# Altium schematic sheet cuk.SchDoc: cuh.SchDoc
size A4; DocumentNumber: 5; SheetNumber: 4; SheetTotal: 4
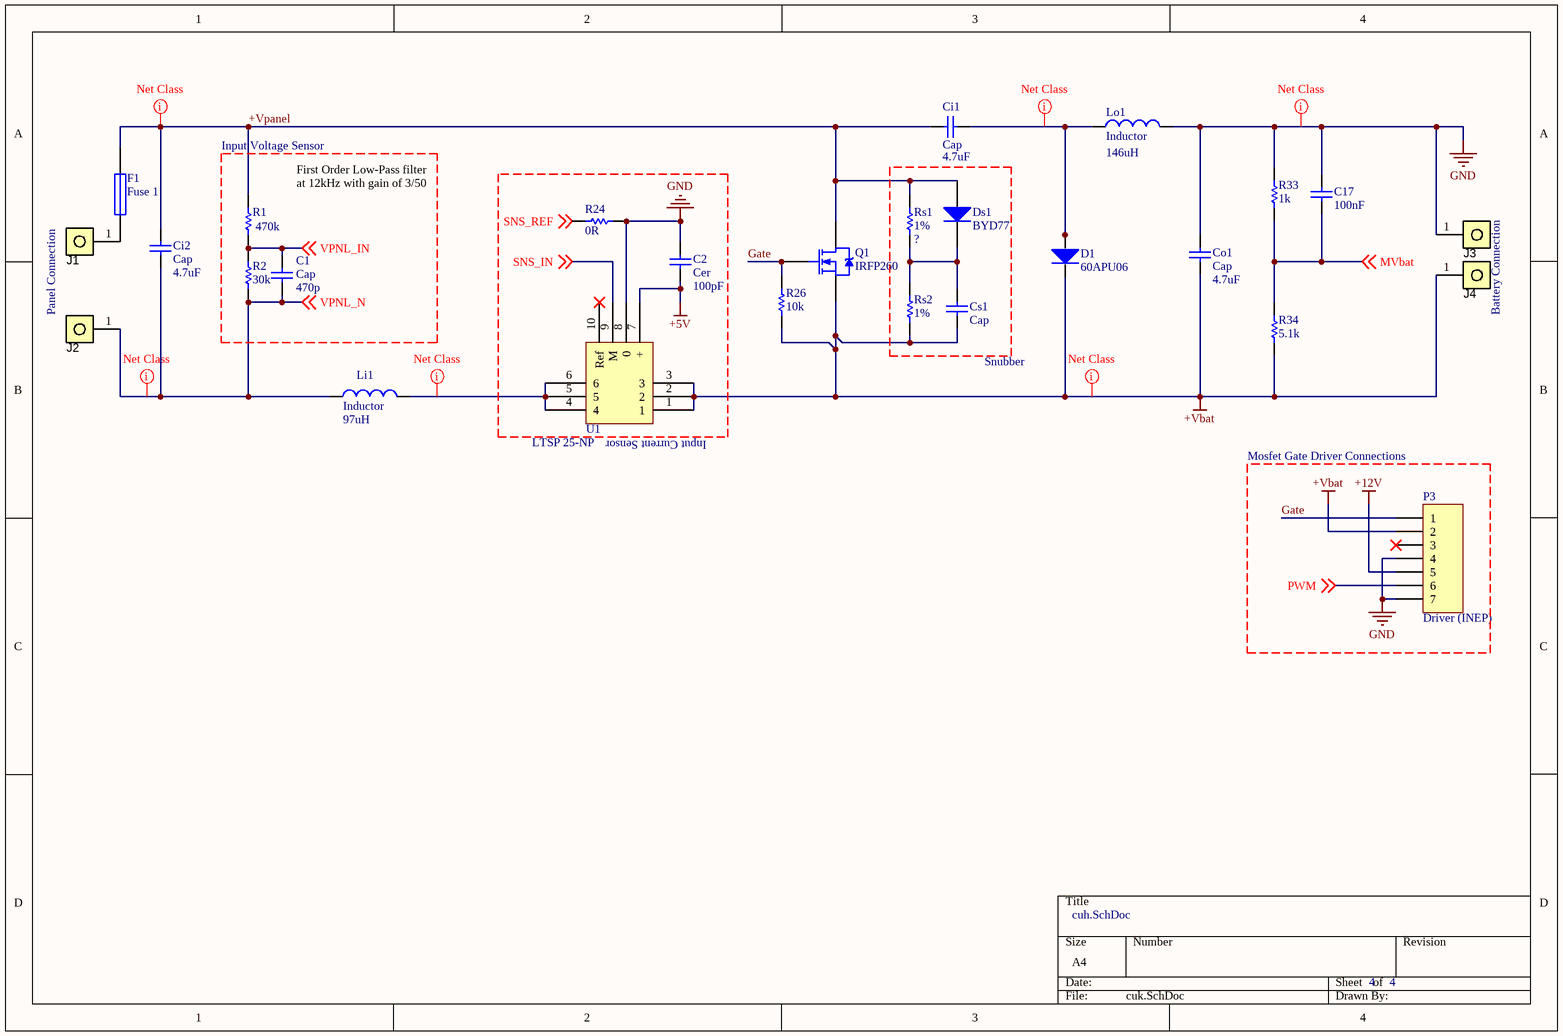
[diagram p0: cuk.SchDoc]

## Parts
C1  Cap  value 470p  [6-0805_N]
C2  Cer  value 100pF  [C1210_M]
C17  100nF  [6-0805_M]
Ci1  Cap  value 4.7uF  [CAP4U7 EPCOS]
Ci2  Cap  value 4.7uF  [CAP4U7 EPCOS]
Co1  Cap  value 4.7uF  [CAP4U7 EPCOS]
Cs1  Cap  [100nF]
D1  60APU06  [to-247ac_horizontal]
Ds1  BYD77  [SOD87]
F1  Fuse 1  [FUSE HOLDER 5X20]
J1  (no value)  [Parafuso]
J2  (no value)  [Parafuso]
J3  (no value)  [Parafuso]
J4  (no value)  [Parafuso]
Li1  Inductor  value 97uH  [NEE-42-20-deitado]
Lo1  Inductor  value 146uH  [NEE-42-20-deitado]
P3  Driver (INEP)  [Driver INEP]
Q1  IRFP260  [to-247ac_horizontal]
R1  value 470k  [6-0805_N]  (hidden comment: Res1)
R2  value 30k  [6-0805_N]  (hidden comment: Res1)
R24  value 0R  [6-0805_N]  (hidden comment: Res1)
R26  value 10k  [6-0805_N]  (hidden comment: Res1)
R33  1k  [6-0805_M]
R34  5.1k  [6-0805_M]
Rs1  1%  [AXIAL-0.3]
Rs2  1%  [AXIAL-0.3]
U1  LTSP 25-NP  [LTSP 25-NP]

## Nets
+5V: C2.1 U1.7(+)
+12V: P3.5
+Vbat: Co1.1 Cs1.1 D1.2(K) J4.1 P3.2 Q1.3(S) R26.2 R34.1 Rs2.2 U1.1 U1.2 U1.3
GND: C2.2 C17.2 Co1.2 J3.1 Lo1.2 P3.4 P3.7 R24.2 R33.2 U1.8(0)
+Vpanel: Ci1.1 Ci2.2 Ds1.1(A) F1.2 Q1.2(D) R1.1 Rs1.2
Gate: P3.1 Q1.1(G) R26.1
MVbat: C17.1 R33.1 R34.2 ; off-sheet MVbat
PWM: P3.6 ; off-sheet PWM
SNS_IN: U1.9(M) ; off-sheet SNS_IN
SNS_REF: R24.1 ; off-sheet SNS_REF
VPNL_IN: C1.1 R1.2 R2.1 ; off-sheet VPNL_IN
VPNL_N: C1.2 Ci2.1 J2.1 Li1.1 R2.2 ; off-sheet VPNL_N
NetCi1_2: Ci1.2 D1.1(A) D1.3(A) Lo1.1
NetCs1_2: Cs1.2 Ds1.2(K) Rs1.1 Rs2.1
NetF1_1: F1.1 J1.1
NetLi1_2: Li1.2 U1.4 U1.5 U1.6

Not connected (* = marked no-connect by the designer): P3 3*; U1 10(Ref)*

## Layout directives
net class PanelBetweenBatteryConnection: +Vbat, +Vpanel, GND, NetCi1_2, NetLi1_2, VPNL_N

## Notes on the sheet
- Input Voltage Sensor
- First Order Low-Pass filter at 12kHz with gain of 3/50
- Panel Connection
- Battery Connection
- (near Cs1) Snubber
- (near U1) Input Current Sensor
- Mosfet Gate Driver Connections

## Library data of the parts
C1 C2 Ci1 Ci2 Co1 Cs1 = Cap: Capacitor; Published: 8-Jun-2000; LatestRevisionDate: 17-Jul-2002; LatestRevisionNote: Re-released for DXP Platform.; PackageReference: RAD-0.3; Publisher: Altium Limited; PackageDescription: Radial Cap, Thru-Hole; 2 Leads; 0.3 in Pin Spacing
  Cs1: Value: ?
C17 = Cap_3: Capacitor; Published: 8-Jun-2000; LatestRevisionDate: 17-Jul-2002; LatestRevisionNote: Re-released for DXP Platform.; PackageReference: RAD-0.3; Publisher: Altium Limited; PackageDescription: Radial Cap, Thru-Hole; 2 Leads; 0.3 in Pin Spacing; Value: 100nF
Ds1 = Diode 1N4002: 1 Amp General Purpose Rectifier; pin to pad: 1>A 2>K; Published: 8-Jun-2000; LatestRevisionDate: 17-Jul-2002; LatestRevisionNote: Re-released for DXP Platform.; DatasheetVersion: 1998; PackageVersion: Aug-1999; PackageReference: DO-41; Publisher: Altium Limited; PackageDescription: Diode, Axial; Body 5.2 x 2.7 mm (LxDia. max), Lead Dia. 0.86 mm (max); Code_JEDEC: DO-204-AL; ComponentLink1Description: Manufacturer Link; ComponentLink1URL: http://www.fairchildsemi.com/; ComponentLink2Description: Datasheet; ComponentLink2URL: http://www.fairchildsemi.com/ds/1N%2F1N4001.pdf; value: BYD77
F1 = Fuse 1: Fuse; Published: 8-Jun-2000; LatestRevisionDate: 17-Jul-2002; LatestRevisionNote: Re-released for DXP Platform.; PackageReference: PIN-W2/E2.8; Publisher: Altium Limited; PackageDescription: Thru-Hole; 2 Leads
J1-J4 = PIN_BIG: Description 1: Header 1x1; Código: PIN_BIG; Footprint: CON_1_big; PackageReference: CON_1_big
Li1 = Inductor: Code_IEC: 1005; Published: 8-Jun-2000; LatestRevisionDate: 29-May-2009; LatestRevisionNote: IPC-7351 Footprint Added.; PackageReference: 0402-A; Publisher: Altium Limited; PackageDescription: Chip Inductor; Code_JEITA: 0402
Lo1 = Inductor: pin to pad: 1>2 2>1; Code_IEC: 1005; Published: 8-Jun-2000; LatestRevisionDate: 29-May-2009; LatestRevisionNote: IPC-7351 Footprint Added.; PackageReference: 0402-A; Publisher: Altium Limited; PackageDescription: Chip Inductor; Code_JEITA: 0402
P3 = Header 7: Header, 7-Pin; LatestRevisionDate: 17-Jul-2002; LatestRevisionNote: Re-released for DXP Platform.; Publisher: Altium Limited
Q1 = IRFP260: HEXFET Power MOSFET; Note: Pin 2 is electrically connected to the Heatsink (4).; Published: 8-Jun-2000; LatestRevisionDate: 17-Jul-2002; LatestRevisionNote: Re-released for DXP Platform.; DatasheetVersion: PD-9.755; PackageVersion: Aug-1997; PackageReference: TO-247AC; Publisher: Altium Limited; PackageDescription: SIP with Mounting Hole; 3 Leads; Body 20 x 15.6 x 5 mm (typ); Pitch 5.45 mm; Code_JEDEC: TO-247-AC; ComponentLink1Description: Manufacturer Link; ComponentLink1URL: http://www.irf.com/; ComponentLink2Description: Datasheet; ComponentLink2URL: http://www.irf.com/product-info/datasheets/data/irfp260.pdf
R1 R2 R24 R26 R33 R34 Rs1 Rs2 = Res1: Resistor; Published: 8-Jun-2000; LatestRevisionDate: 17-Jul-2002; LatestRevisionNote: Re-released for DXP Platform.; PackageReference: AXIAL-0.3; Publisher: Altium Limited; PackageDescription: Axial Device, Thru-Hole; 2 Leads; 0.3 in Pin Spacing
  R33: Value: 1k
  R34: Value: 5.1k
  Rs1 Rs2: Value: ?
U1 = LTSP 25-NP: Current Transducer LTSP (25 A)